# EAGLE design woda (EAGLE 7.0.0)
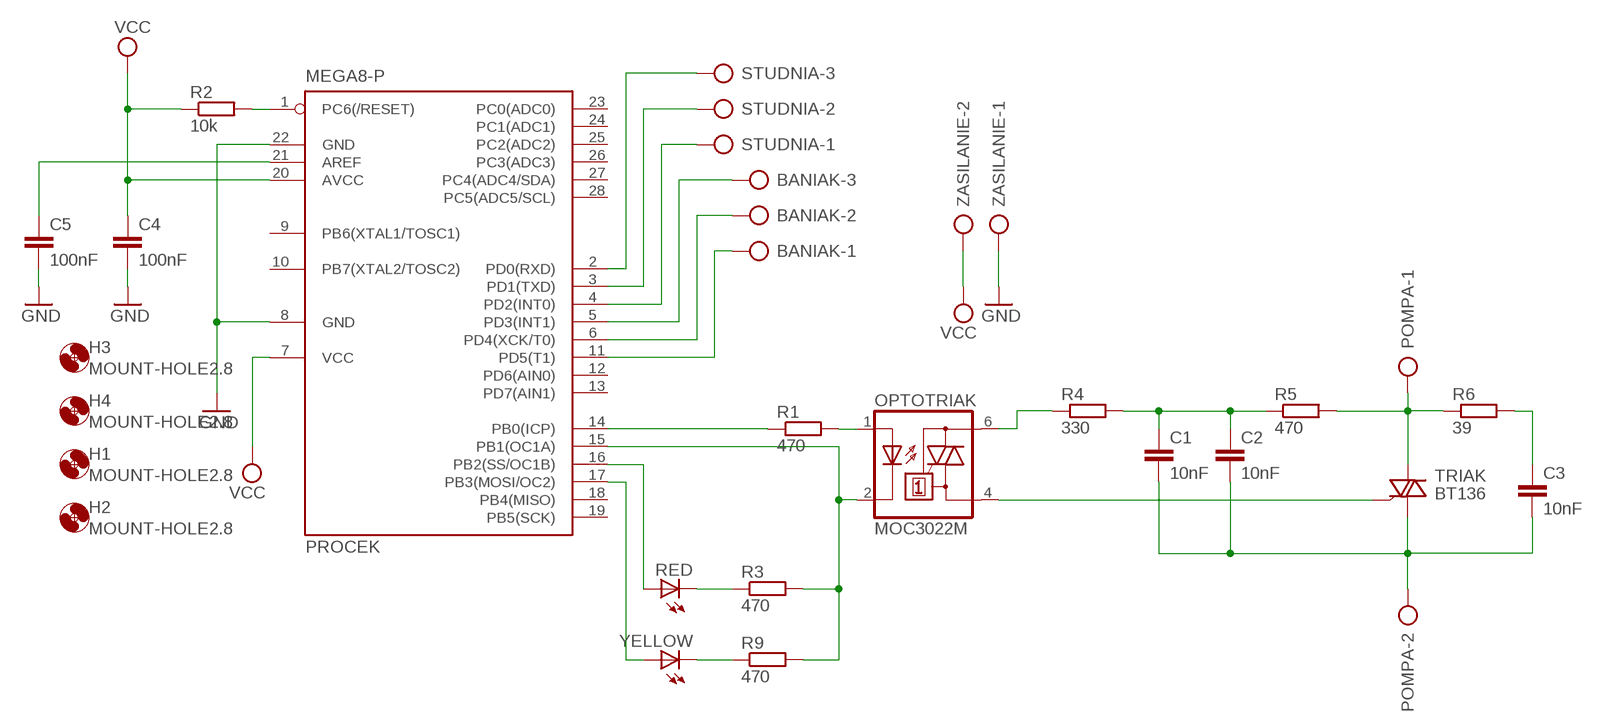
[diagram p0: schematic, sheet 1]

## Parts
BANIAK  AK300/3  [AK300/3]
C1  10nF  C10/4  [C10B4]
C2  10nF  C10/4  [C10B4]
C3  10nF  C10/4  [C10B4]
C4  100nF  C2.5/2  [C2.5-2]
C5  100nF  C2.5/2  [C2.5-2]
H1  MOUNT-HOLE2.8  [2,8]
H2  MOUNT-HOLE2.8  [2,8]
H3  MOUNT-HOLE2.8  [2,8]
H4  MOUNT-HOLE2.8  [2,8]
OPTOTRIAK  MOC3022M  [DIL06]
POMPA  AK300/2  [AK300/2]
PROCEK  MEGA8-P  [DIL28-3]
R1  470  R-EU_0207/15  [0207/15]
R2  10k  R-EU_0207/15  [0207/15]
R3  470  R-EU_0207/15  [0207/15]
R4  330  R-EU_0207/7  [0207/7]
R5  470  R-EU_0207/7  [0207/7]
R6  39  R-EU_0207/7  [0207/7]
R9  470  R-EU_0207/15  [0207/15]
RED  LED3MM  [LED3MM]
STUDNIA  AK300/3  [AK300/3]
TRIAK  BT136  [TO220AB]
YELLOW  LED3MM  [LED3MM]
ZASILANIE  AK300/2  [AK300/2]

## Nets
GND: C4.2 C5.2 PROCEK.8(GND) PROCEK.22(GND) ZASILANIE.1
N$1: OPTOTRIAK.2(C) PROCEK.15(PB1(OC1A)) R3.2 R9.2
N$2: C1.2 C2.2 C3.2 POMPA.2 TRIAK.1(A1)
N$3: OPTOTRIAK.1(A) R1.2
N$4: C5.1 PROCEK.21(AREF)
N$5: PROCEK.1(PC6(/RESET)) R2.2
N$6: PROCEK.2(PD0(RXD)) STUDNIA.3
N$7: PROCEK.3(PD1(TXD)) STUDNIA.2
N$8: PROCEK.4(PD2(INT0)) STUDNIA.1
N$9: BANIAK.3 PROCEK.5(PD3(INT1))
N$10: BANIAK.2 PROCEK.6(PD4(XCK/T0))
N$11: BANIAK.1 PROCEK.11(PD5(T1))
N$12: PROCEK.16(PB2(SS/OC1B)) RED.A
N$13: PROCEK.17(PB3(MOSI/OC2)) YELLOW.A
N$14: R3.1 RED.K(C)
N$15: R9.1 YELLOW.K(C)
N$16: PROCEK.14(PB0(ICP)) R1.1
N$17: POMPA.1 R5.2 R6.1 TRIAK.2(A2)
N$19: OPTOTRIAK.4(A1) TRIAK.3(G)
N$20: C3.1 R6.2
N$22: OPTOTRIAK.6(A2) R4.1
N$23: C1.1 C2.1 R4.2 R5.1
VCC: C4.1 PROCEK.7(VCC) PROCEK.20(AVCC) R2.1 ZASILANIE.2
Unconnected: PROCEK.9(PB6(XTAL1/TOSC1)) PROCEK.10(PB7(XTAL2/TOSC2)) PROCEK.12(PD6(AIN0)) PROCEK.13(PD7(AIN1)) PROCEK.18(PB4(MISO)) PROCEK.19(PB5(SCK)) PROCEK.23(PC0(ADC0)) PROCEK.24(PC1(ADC1)) PROCEK.25(PC2(ADC2)) PROCEK.26(PC3(ADC3)) PROCEK.27(PC4(ADC4/SDA)) PROCEK.28(PC5(ADC5/SCL))

## Library data of the parts
BANIAK STUDNIA = con-ptr500:AK300/3: CONNECTOR; OC_FARNELL: unknown; OC_NEWARK: unknown
C1-C5 = capacitor-wima:C: CAPACITOR naming: grid - package width
H1-H4 = holes:MOUNT-HOLE: MOUNTING HOLE with drill center marker
OPTOTRIAK = optocoupler:MOC30*M: RANDOM-PHASE OPTOISOLATORS TRIAC DRIVER OUTPUT Source: http://www.fairchildsemi.com MOC3020-M.pdf; MF: FAIRCHILD SEMICONDUCTOR; MPN: MOC3022-M; OC_FARNELL: 1021086; OC_NEWARK: 58K1956
POMPA ZASILANIE = con-ptr500:AK300/2: CONNECTOR; OC_FARNELL: unknown; OC_NEWARK: unknown
PROCEK = atmel:MEGA8-P: MICROCONTROLLER 8 Kbytes FLASH, 1 kbytes SRAM, 512 bytes EEPROM, USART, 4-channel 10 bit ADC, 2-channel 8 bit ADC Pin compatible with Atmega48, ATMega88, ATMega168 Source: avr.lbr; OC_FARNELL: unknown; OC_NEWARK: unknown
R1-R6 R9 = resistor:R-EU_: RESISTOR, European symbol
RED YELLOW = led:LED: LED OSRAM: - CHIPLED LG R971, LG N971, LY N971, LG Q971, LY Q971, LO R971, LY R971 LH N974, LH R974 LS Q976, LO Q976, LY Q976 LO Q996 - Hyper CHIPLED LW Q18S LB Q993, LB Q99A, LB R99A - SideLED LS A670, LO A670, LY A670, LG A670, LP A670 LB A673, LV A673, LT A673, LW A673 LH A674 LY A675 LS A676, LA A676, LO A676, LY A676, LW A676 LS A679, LY A679, LG A679 - Hyper Micro SIDELED® LS Y876, LA Y876, LO Y876, LY Y876 LT Y87S - SmartLED LW L88C, LW L88S LB L89C, LB L89S, LG L890 LS L89K, LO L89K, LY L89K LS L896, LA L896, LO L896, LY L896 - TOPLED LS T670, LO T670, LY T670, LG T670, LP T670 LSG T670, LSP T670, LSY T670, LOP T670, LYG T670 LG T671, LOG T671, LSG T671 LB T673, LV T673, LT T673, LW T673 LH T674 LS T676, LA T676, LO T676, LY T676, LB T676, LH T676, LSB T676, LW T676 LB T67C, LV T67C, LT T67C, LS T67K, LO T67K, LY T67K, LW E67C LS E67B, LA E67B, LO E67B, LY E67B, LB E67C, LV E67C, LT E67C LW T67C LS T679, LY T679, LG T679 LS T770, LO T770, LY T770, LG T770, LP T770 LB T773, LV T773, LT T773, LW T773 LH T774 LS E675, LA E675, LY E675, LS T675 LS T776, LA T776, LO T776, LY T776, LB T776 LHGB T686 LT T68C, LB T68C - Hyper Mini TOPLED® LB M676 - Mini TOPLED Santana® LG M470 LS M47K, LO M47K, LY M47K Source: http://www.osram.convergy.de LUXEON: - LUMILED® LXK2-PW12-R00, LXK2-PW12-S00, LXK2-PW14-U00, LXK2-PW14-V00 LXK2-PM12-R00, LXK2-PM12-S00, LXK2-PM14-U00 LXK2-PE12-Q00, LXK2-PE12-R00, LXK2-PE12-S00, LXK2-PE14-T00, LXK2-PE14-U00 LXK2-PB12-K00, LXK2-PB12-L00, LXK2-PB12-M00, LXK2-PB14-N00, LXK2-PB14-P00, LXK2-PB14-Q00 LXK2-PR12-L00, LXK2-PR12-M00, LXK2-PR14-Q00, LXK2-PR14-R00 LXK2-PD12-Q00, LXK2-PD12-R00, LXK2-PD12-S00 LXK2-PH12-R00, LXK2-PH12-S00 LXK2-PL12-P00, LXK2-PL12-Q00, LXK2-PL12-R00 Source: www.luxeon.com KINGBRIGHT: KA-3528ASYC Source: www.kingbright.com
TRIAK = triac:BT136: Triac BT136 series E sensitive gate Source: http://www.nxp.com/acrobat_download/datasheets/BT136_SERIES_E_2.pdf

## Board
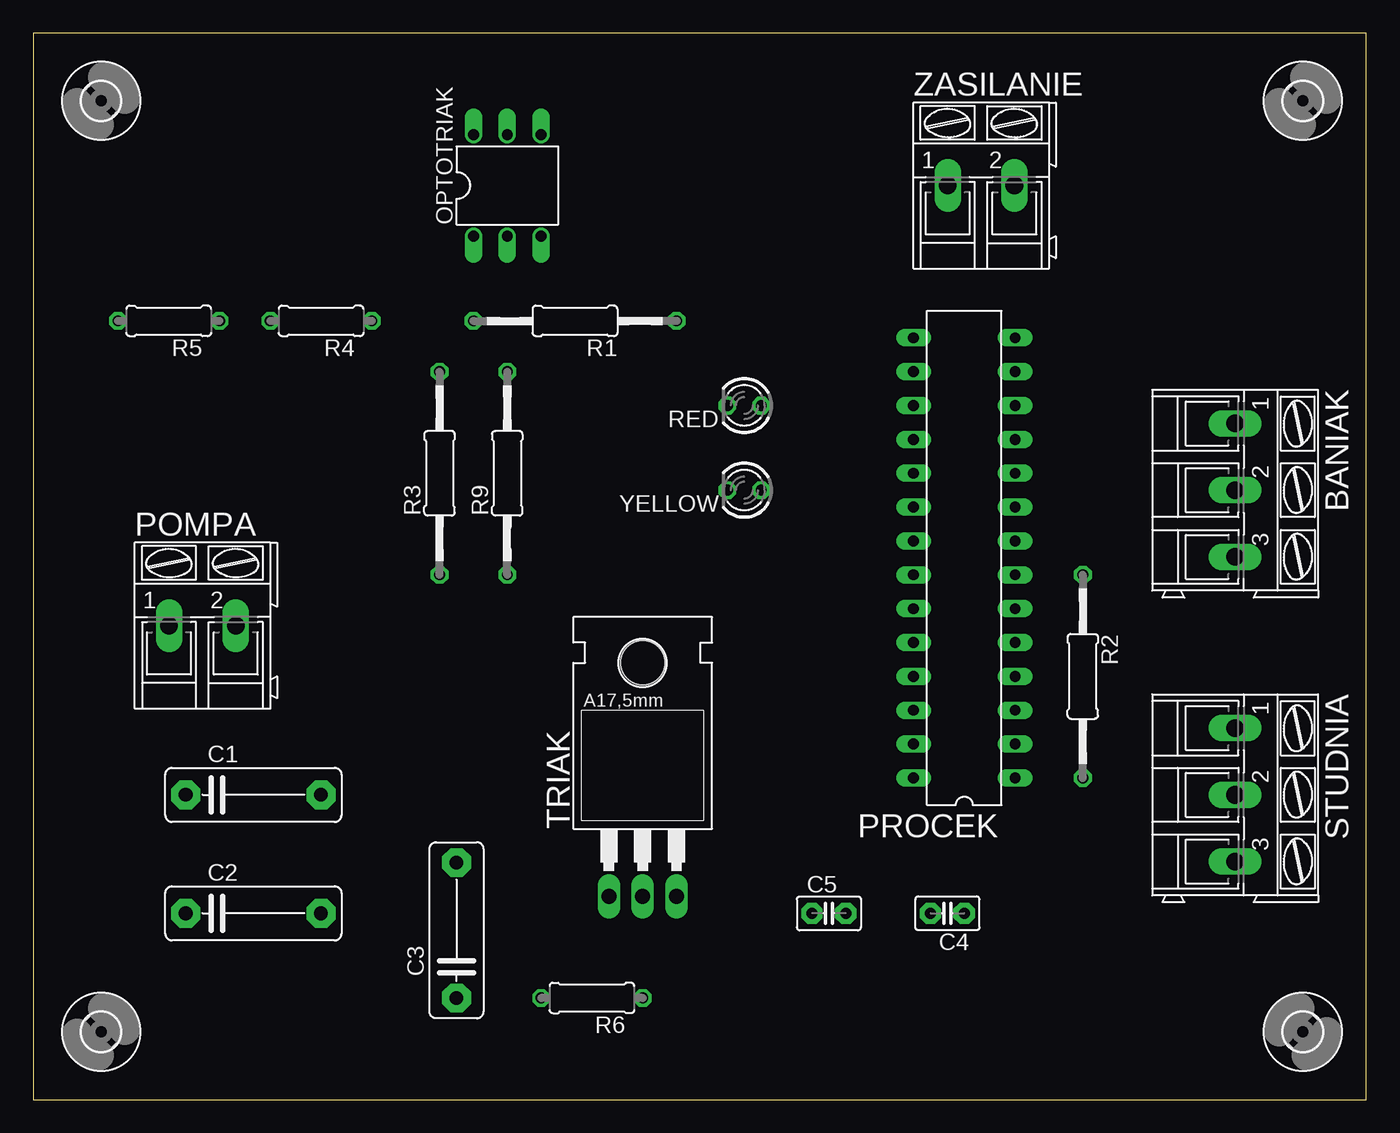
[diagram p1: board, top side]
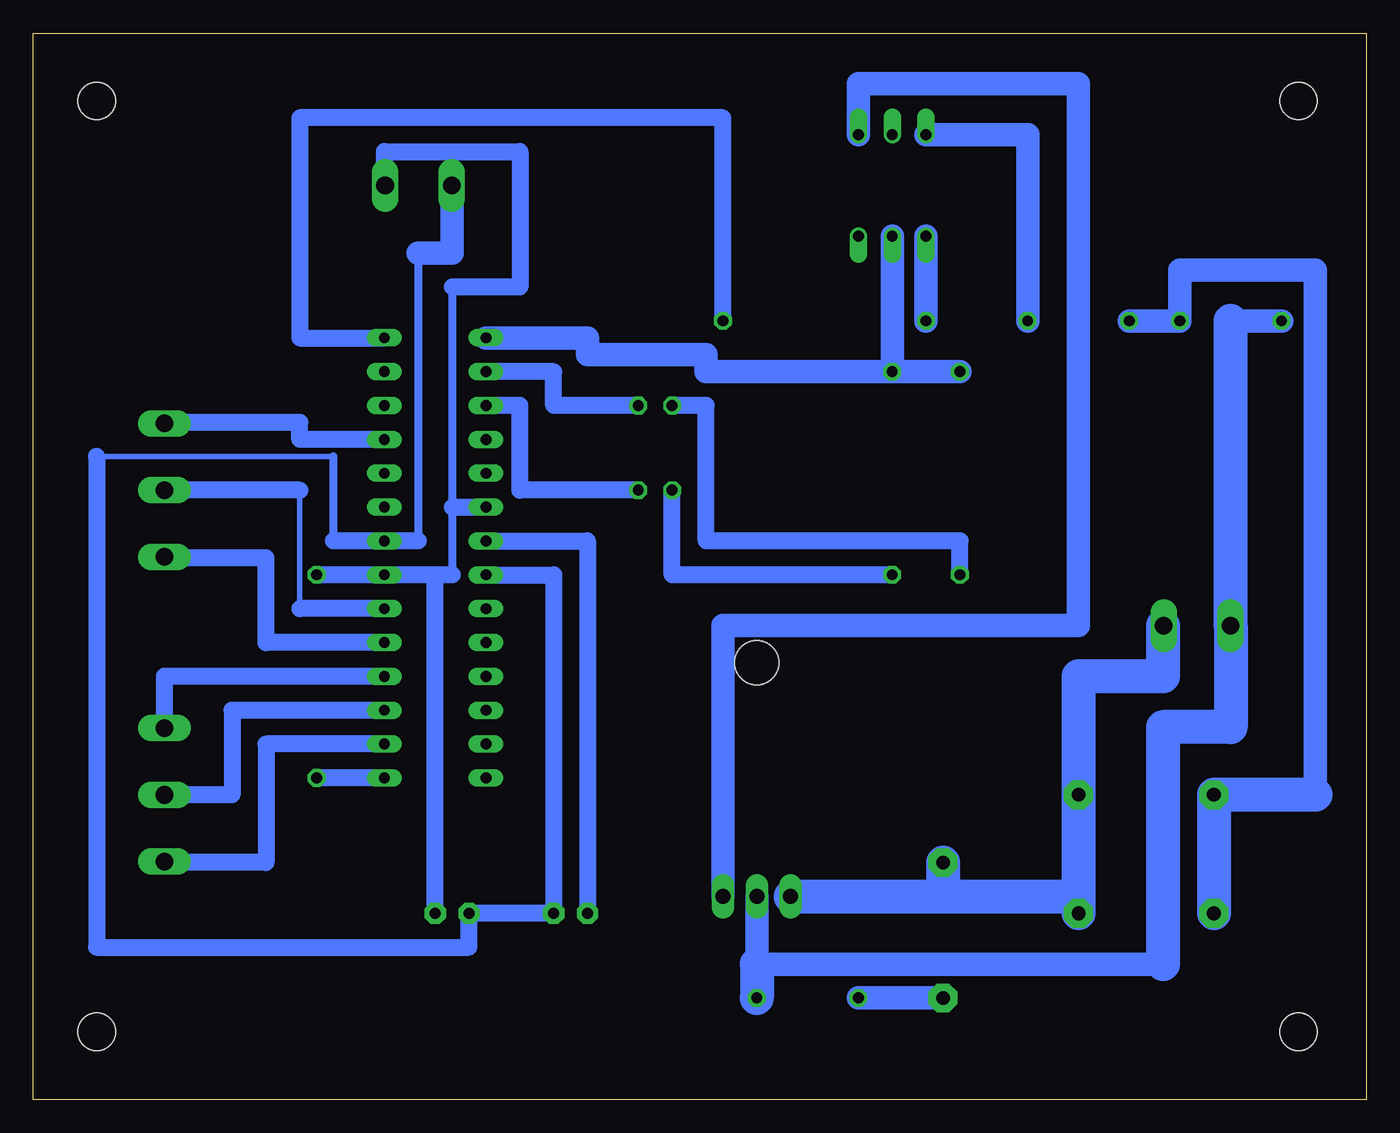
[diagram p2: board, bottom side, seen from below]

Size 100 x 80 mm. Coordinates in mm from the lower left corner, seen from the top.
Outline: 0,0 100,0 100,80 0,80 0,0
Copper layers (1*16): Top 0.035mm / dielectric 1.5mm / Bottom 0.035mm
Design rules "default": minimum track width 10mil, minimum drill 24mil, track to track 8mil, track to pad 8mil, pad to pad 8mil, via to via 8mil, smd to smd 8mil, copper to edge 40mil, drill to drill 8mil, minimum pad ring 10mil, minimum via ring 8mil, stop-mask expansion 4mil, vias tented up to drill 0mil, thermal gap 10mil

### Footprints (pad centres in the part's own frame; a part is rotated, then mirrored left to right if it is on the bottom)
AK300/3 = drill 1.321 long: 1 -5.004,0; 2 0,0; 3 5.004,0
C10B4 = drill 1.016 pad 2.159 octagon: 1 -5.08,0; 2 5.08,0
C2.5-2 = drill 0.813 pad 1.6 octagon: 1 -1.27,0; 2 1.27,0
2,8 = hole 2.8: 0,0
DIL06 = drill 0.813 offset: 1 -2.54,-3.81; 2 0,-3.81; 3 2.54,-3.81; 4 2.54,3.81; 5 0,3.81; 6 -2.54,3.81
AK300/2 = drill 1.321 long: 1 -2.515,0; 2 2.489,0
DIL28-3 = drill 0.813 long: 1 -16.51,-3.81; 2 -13.97,-3.81; 3 -11.43,-3.81; 4 -8.89,-3.81; 5 -6.35,-3.81; 6 -3.81,-3.81; 7 -1.27,-3.81; 8 1.27,-3.81; 9 3.81,-3.81; 10 6.35,-3.81; 11 8.89,-3.81; 12 11.43,-3.81; 13 13.97,-3.81; 14 16.51,-3.81; 15 16.51,3.81; 16 13.97,3.81; 17 11.43,3.81; 18 8.89,3.81; 19 6.35,3.81; 20 3.81,3.81; 21 1.27,3.81; 22 -1.27,3.81; 23 -3.81,3.81; 24 -6.35,3.81; 25 -8.89,3.81; 26 -11.43,3.81; 27 -13.97,3.81; 28 -16.51,3.81
0207/15 = drill 0.813 octagon: 1 -7.62,0; 2 7.62,0
0207/7 = drill 0.813 octagon: 1 -3.81,0; 2 3.81,0
LED3MM = drill 0.813 octagon: A -1.27,0; K 1.27,0
TO220AB = drill 1.118 long: 1 -2.54,-6.35; 2 0,-6.35; 3 2.54,-6.35 | hole 3.302: 0,11.176

### Placement (x,y rotation side)
BANIAK  90.17,45.72 270 top
C1  16.51,22.86 0 top
C2  16.51,13.97 0 top
C3  31.75,12.7 90 top
C4  68.58,13.97 180 top
C5  59.69,13.97 0 top
H1  95.25,5.08 93.8 top
H2  5.08,5.08 0 top
H3  95.25,74.93 0 top
H4  5.08,74.93 0 top
OPTOTRIAK  35.56,68.58 0 top
POMPA  12.7,35.56 0 top
PROCEK  69.85,40.64 90 top
R1  40.64,58.42 180 top
R2  78.74,31.75 270 top
R3  30.48,46.99 90 top
R4  21.59,58.42 180 top
R5  10.16,58.42 180 top
R6  41.91,7.62 180 top
R9  35.56,46.99 90 top
RED  53.34,52.07 180 top
STUDNIA  90.17,22.86 270 top
TRIAK  45.72,21.59 0 top
YELLOW  53.34,45.72 180 top
ZASILANIE  71.12,68.58 0 top

### Tracks (layer width: path | path; a pad name or v marks a point on that pad's centre or on a via)
GND
  Bottom 0.406: ZASILANIE.1 68.58,68.58 | 77.47,48.26 95.25,48.26
  Bottom 0.61: 71.12,63.5 71.12,41.91 | 77.47,41.91 77.47,48.26
  Bottom 1.27: 71.12,41.91 PROCEK.8 77.47,41.91 | PROCEK.22 60.96,39.37 C5.2 C4.2 67.31,11.43 95.25,11.43 95.25,48.26
  Bottom 1.778: 68.58,68.58 68.58,63.5 71.12,63.5
N$1
  Bottom 1.778: OPTOTRIAK.2 R9.2 | R3.2 R9.2 | R9.2 49.53,54.61 49.53,55.88 58.42,55.88 58.42,57.15 PROCEK.15
N$2
  Bottom 0.406: POMPA.2 15.24,35.56
  Bottom 2.54: 21.59,15.24 C1.2 21.59,31.75 15.24,31.75 15.24,35.56 | 21.59,15.24 C2.2 | TRIAK.1 31.75,15.24 | 31.75,15.24 21.59,15.24 | C3.2 31.75,15.24
N$3
  Bottom 1.778: OPTOTRIAK.1 R1.2
N$4
  Bottom 1.27: PROCEK.21 58.42,41.91 C5.1
N$5
  Bottom 1.27: PROCEK.1 R2.2
N$6
  Bottom 0.406: 90.17,17.78 STUDNIA.3
  Bottom 1.27: PROCEK.2 82.55,26.67 82.55,17.78 90.17,17.78
N$7
  Bottom 1.27: PROCEK.3 85.09,29.21 85.09,22.86 STUDNIA.2
N$8
  Bottom 1.27: PROCEK.4 90.17,31.75 STUDNIA.1
N$9
  Bottom 0.406: 90.17,40.64 BANIAK.3
  Bottom 1.27: PROCEK.5 82.55,34.29 82.55,40.64 90.17,40.64
N$10
  Bottom 0.406: 80.01,36.83 80.01,45.72
  Bottom 1.27: PROCEK.6 80.01,36.83 | 80.01,45.72 BANIAK.2
N$11
  Bottom 0.406: 90.17,50.8 BANIAK.1
  Bottom 1.27: PROCEK.11 80.01,49.53 80.01,50.8 90.17,50.8
N$12
  Bottom 1.27: RED.A 60.96,52.07 60.96,54.61 PROCEK.16
N$13
  Bottom 1.27: YELLOW.A 63.5,45.72 63.5,52.07 PROCEK.17
N$14
  Bottom 1.27: R3.1 30.48,41.91 49.53,41.91 49.53,52.07 RED.K
N$15
  Bottom 1.27: R9.1 52.07,39.37 YELLOW.K
N$16
  Bottom 1.27: R1.1 48.26,73.66 80.01,73.66 80.01,57.15 PROCEK.14
N$17
  Bottom 0.406: POMPA.1 10.16,35.56
  Bottom 1.778: R5.2 10.19,58.42 | TRIAK.2 45.72,10.16 15.24,10.16
  Bottom 2.54: 10.19,58.42 POMPA.1 | 45.72,10.16 R6.1 | 10.16,35.56 10.16,27.94 15.24,27.94 15.24,10.16
N$19
  Bottom 1.778: OPTOTRIAK.4 38.1,76.2 21.59,76.2 21.59,35.56 48.26,35.56 TRIAK.3
N$20
  Bottom 1.778: C3.1 R6.2
N$22
  Bottom 1.778: R4.1 25.4,72.39 OPTOTRIAK.6
N$23
  Bottom 1.778: R4.2 R5.1 13.97,62.23 3.81,62.23 3.81,22.86
  Bottom 2.54: 3.81,22.86 C1.1 C2.1
VCC
  Bottom 0.406: ZASILANIE.2 73.66,68.58
  Bottom 0.61: 68.58,60.96 68.58,44.45 68.58,39.37
  Bottom 1.27: 73.66,68.58 73.66,71.12 63.5,71.12 63.5,60.96 68.58,60.96 | 68.58,44.45 PROCEK.20 | 68.58,39.37 69.85,39.37 | 69.85,39.37 PROCEK.7 R2.1 | C4.1 69.85,39.37